# Altium schematic sheet LPDDR4X_Power.SchDoc
size A3; SheetNumber: 13; SheetTotal: 36
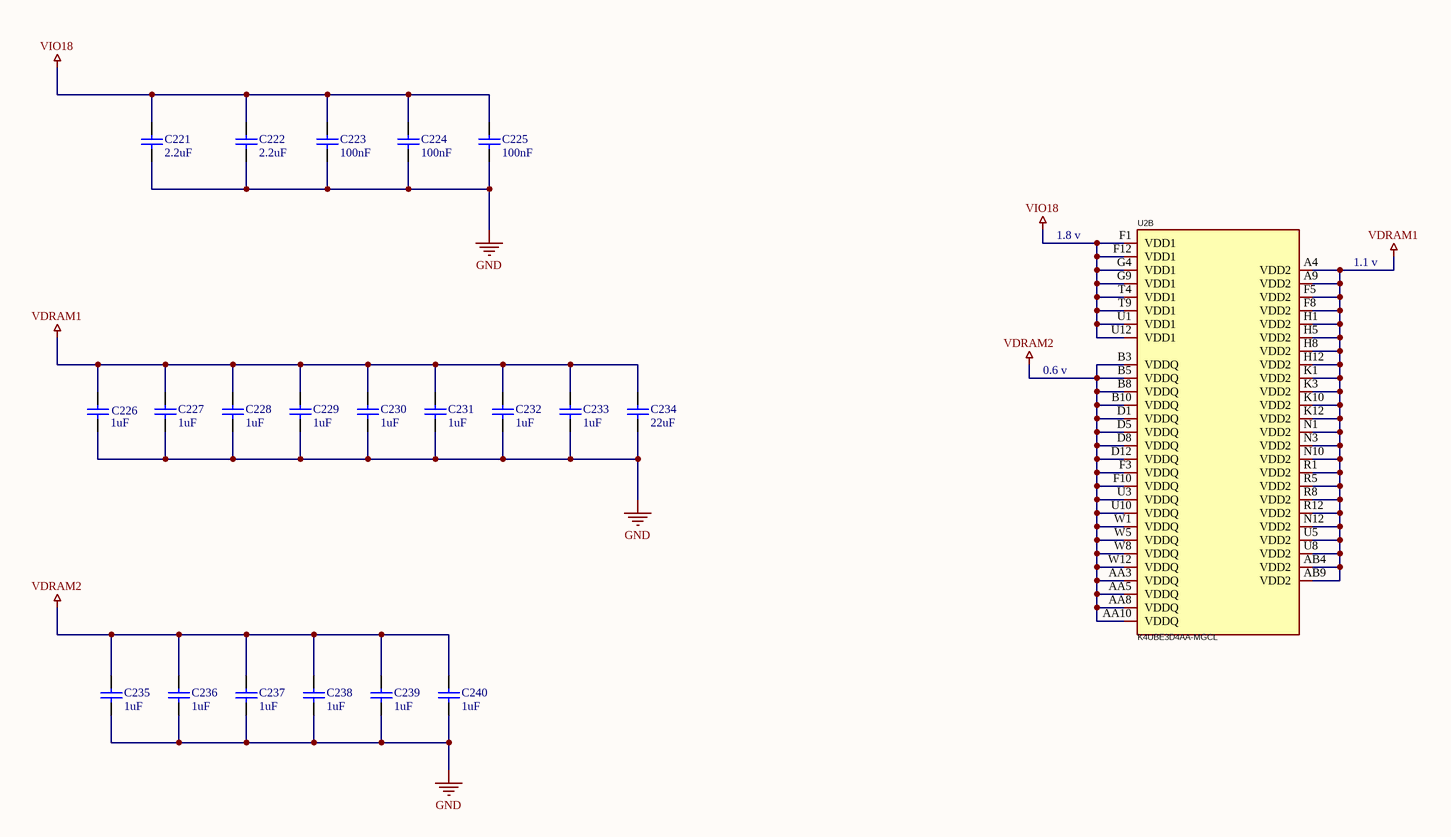
[diagram p0: LPDDR4X_Power.SchDoc]

## Parts
C221  value 2.2uF  [C0805]  (hidden comment: C0805)
C222  value 2.2uF  [C0805]  (hidden comment: C0805)
C223  value 100nF  [C0603]  (hidden comment: C0603)
C224  value 100nF  [C0603]  (hidden comment: C0603)
C225  value 100nF  [C0603]  (hidden comment: C0603)
C226  value 1uF  [C0805]  (hidden comment: C0805)
C227  value 1uF  [C0805]  (hidden comment: C0805)
C228  value 1uF  [C0805]  (hidden comment: C0805)
C229  value 1uF  [C0805]  (hidden comment: C0805)
C230  value 1uF  [C0805]  (hidden comment: C0805)
C231  value 1uF  [C0805]  (hidden comment: C0805)
C232  value 1uF  [C0805]  (hidden comment: C0805)
C233  value 1uF  [C0805]  (hidden comment: C0805)
C234  value 22uF  [C1210]  (hidden comment: C1210)
C235  value 1uF  [C0805]  (hidden comment: C0805)
C236  value 1uF  [C0805]  (hidden comment: C0805)
C237  value 1uF  [C0805]  (hidden comment: C0805)
C238  value 1uF  [C0805]  (hidden comment: C0805)
C239  value 1uF  [C0805]  (hidden comment: C0805)
C240  value 1uF  [C0805]  (hidden comment: C0805)
U2  K4UBE3D4AA-MGCL  [K4F8E304HB-MGCJ]  (part B of 5)

## Nets
GND: C221.1 C222.1 C223.1 C224.1 C225.1 C226.1 C227.1 C228.1 C229.1 C230.1 C231.1 C232.1 C233.1 C234.1 C235.1 C236.1 C237.1 C238.1 C239.1 C240.1
VDRAM1: C226.2 C227.2 C228.2 C229.2 C230.2 C231.2 C232.2 C233.2 C234.2 U2.A4(VDD2) U2.A9(VDD2) U2.AB4(VDD2) U2.AB9(VDD2) U2.F5(VDD2) U2.F8(VDD2) U2.H1(VDD2) U2.H5(VDD2) U2.H8(VDD2) U2.H12(VDD2) U2.K1(VDD2) U2.K3(VDD2) U2.K10(VDD2) U2.K12(VDD2) U2.N1(VDD2) U2.N3(VDD2) U2.N10(VDD2) U2.N12(VDD2) U2.R1(VDD2) U2.R5(VDD2) U2.R8(VDD2) U2.R12(VDD2) U2.U5(VDD2) U2.U8(VDD2)
VDRAM2: C235.2 C236.2 C237.2 C238.2 C239.2 C240.2 U2.AA3(VDDQ) U2.AA5(VDDQ) U2.AA8(VDDQ) U2.AA10(VDDQ) U2.B3(VDDQ) U2.B5(VDDQ) U2.B8(VDDQ) U2.B10(VDDQ) U2.D1(VDDQ) U2.D5(VDDQ) U2.D8(VDDQ) U2.D12(VDDQ) U2.F3(VDDQ) U2.F10(VDDQ) U2.U3(VDDQ) U2.U10(VDDQ) U2.W1(VDDQ) U2.W5(VDDQ) U2.W8(VDDQ) U2.W12(VDDQ)
VIO18: C221.2 C222.2 C223.2 C224.2 C225.2 U2.F1(VDD1) U2.F12(VDD1) U2.G4(VDD1) U2.G9(VDD1) U2.T4(VDD1) U2.T9(VDD1) U2.U1(VDD1) U2.U12(VDD1)

## Notes on the sheet
- (near U2) 1.8 v
- 1.1 v
- 0.6 v

## Library data of the parts
U2 = K4UBE3D4AA-MGCL: Manufacturer: SAMSUNG(三星半导体); Add into BOM: yes; Memory Format: SDRAM LPDDR4X; Clock Frequency (fc): 2133MHz; Memory Size: 32Gbit; Supply Voltage: 1.7V~1.95V; Symbol: K4UBE3D4AA-MGCL; Device: K4UBE3D4AA-MGCL; LCSC Part Name: K4UBE3D4AA-MGCL 停产; Supplier Part: C2920257; Manufacturer Part: K4UBE3D4AA-MGCL; Supplier Footprint: FBGA-200; JLCPCB Part Class: Extended Part; Datasheet: https://atta.szlcsc.com/upload/public/pdf/source/20231024/5530CB18C2033A14DEC9B3A35E728586.pdf; Supplier: LCSC; Convert to PCB: yes; Supply current: -; Refresh Current: -; Operating Temperature: -25℃~+85℃